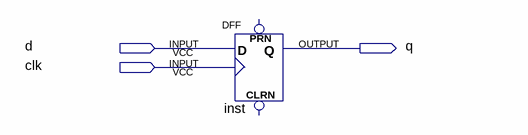
[diagram p0: schematic sheet]
// Quartus schematic lab9b1.bdf as structural Verilog: 1 symbols, 3 pins
module lab9b1 (
  input  d,
  input  clk,
  output q
);

  DFF inst (.CLK(clk), .D(d), .Q(q));  // open: CLRN, PRN
endmodule
